# EAGLE schematic hm3_redraw (EAGLE 8.5.1)
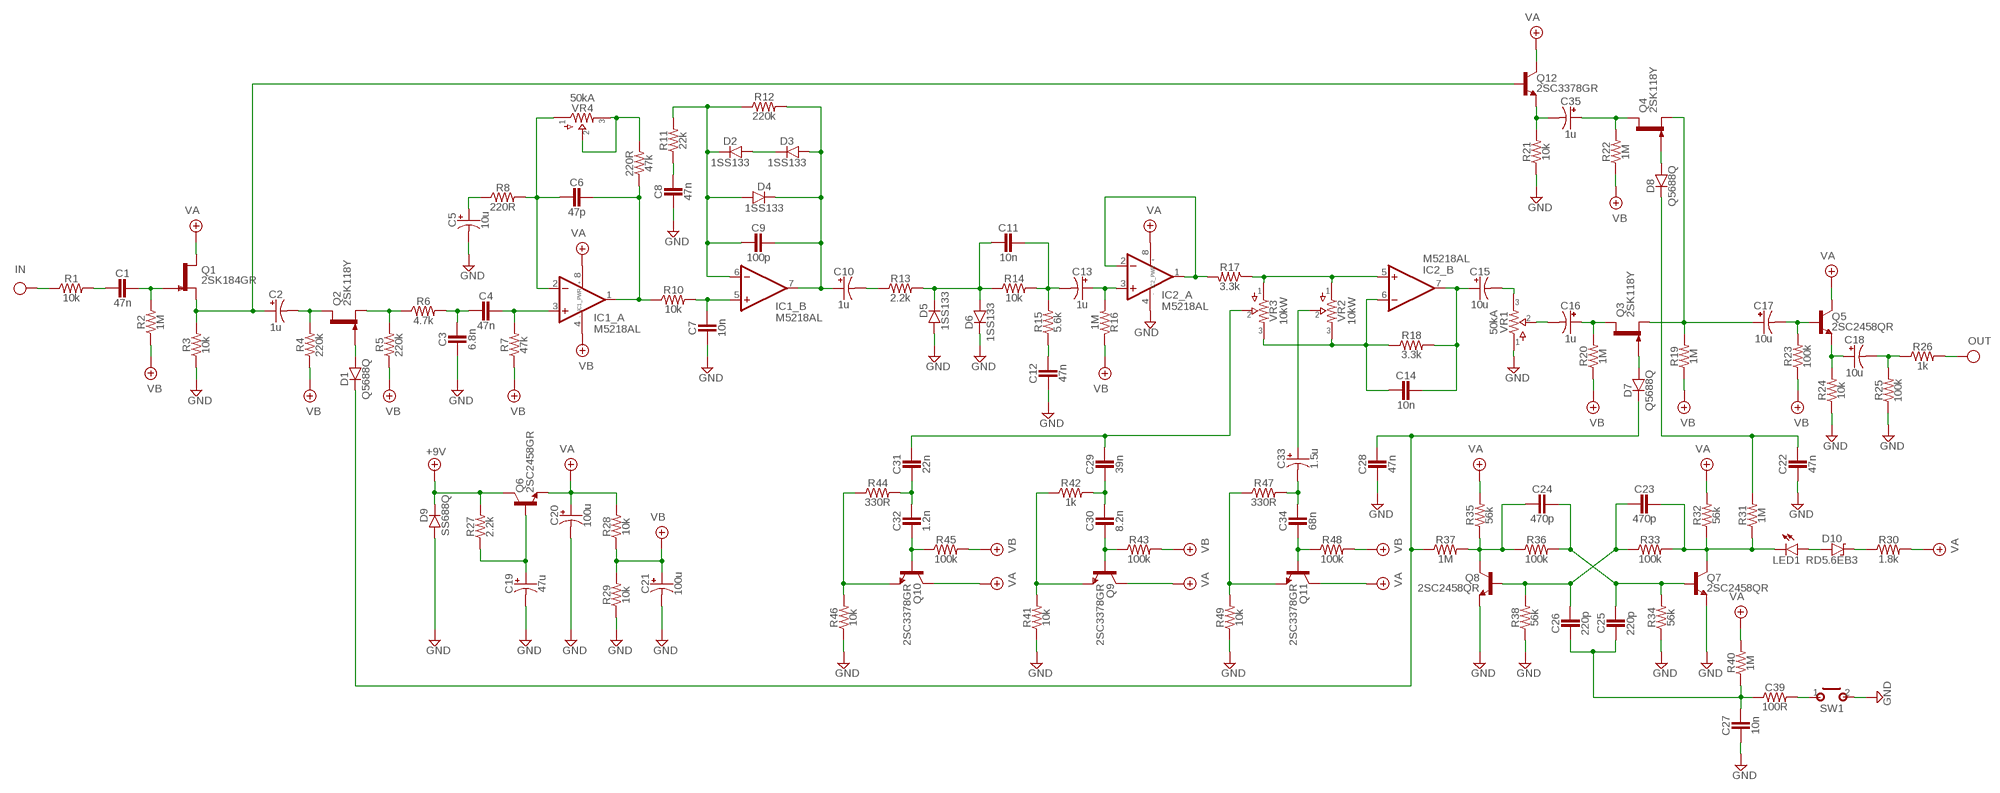
[diagram p0: schematic, sheet 1]

## Parts
220R  47k  R_.3B  [R0207/3]
C1  47n  CER/FILMBOX.1  [BOX_SMALL]
C2  1u  0500  [050_020]
C3  6.8n  CER/FILMBOX.1  [BOX_SMALL]
C4  47n  CER/FILMBOX.1  [BOX_SMALL]
C5  10u  0500  [050_020]
C6  47p  CER/FILMBOX.1  [BOX_SMALL]
C7  10n  CER/FILMBOX.1  [BOX_SMALL]
C8  47n  CER/FILMBOX.1  [BOX_SMALL]
C9  100p  CER/FILMBOX.1  [BOX_SMALL]
C10  1u  0500  [050_020]
C11  10n  CER/FILMBOX.1  [BOX_SMALL]
C12  47n  CER/FILMBOX.1  [BOX_SMALL]
C13  1u  0500  [050_020]
C14  10n  CER/FILMBOX.1  [BOX_SMALL]
C15  10u  0500  [050_020]
C16  1u  0500  [050_020]
C17  10u  0500  [050_020]
C18  10u  0500  [050_020]
C19  47u  0500  [050_020]
C20  100u  0500  [050_020]
C21  100u  0500  [050_020]
C22  47n  CER/FILMBOX.1  [BOX_SMALL]
C23  470p  CER/FILMBOX.1  [BOX_SMALL]
C24  470p  CER/FILMBOX.1  [BOX_SMALL]
C25  220p  CER/FILMBOX.1  [BOX_SMALL]
C26  220p  CER/FILMBOX.1  [BOX_SMALL]
C27  10n  CER/FILMBOX.1  [BOX_SMALL]
C28  47n  CER/FILMBOX.1  [BOX_SMALL]
C29  39n  CER/FILMBOX.1  [BOX_SMALL]
C30  8.2n  CER/FILMBOX.1  [BOX_SMALL]
C31  22n  CER/FILMBOX.1  [BOX_SMALL]
C32  1.2n  CER/FILMBOX.1  [BOX_SMALL]
C33  1.5u  0500  [050_020]
C34  68n  CER/FILMBOX.1  [BOX_SMALL]
C35  1u  0500  [050_020]
C39  100R  R_.3B  [R0207/3]
D1  Q5688Q  DO35.2  [DO35-2]
D2  1SS133  DO35.2  [DO35-2]
D3  1SS133  DO35.2  [DO35-2]
D4  1SS133  DO35.2  [DO35-2]
D5  1SS133  DO35.2  [DO35-2]
D6  1SS133  DO35.2  [DO35-2]
D7  Q5688Q  DO35.2  [DO35-2]
D8  Q5688Q  DO35.2  [DO35-2]
D9  SS688Q  DO35.2  [DO35-2]
D10  RD5.6EB3  ZENER.2  [DO41-2]
IC1  M5218AL  DUALTH  [DIL0]
IC2  M5218AL  DUALSIL  [SIL08]
LED1  LED  [3MM_D]
Q1  2SK184GR  2N5457  [TO92-]
Q2  2SK118Y  2N5457  [TO92-]
Q3  2SK118Y  2N5457  [TO92-]
Q4  2SK118Y  2N5457  [TO92-]
Q5  2SC2458QR  2SC828A  [TO92-]
Q6  2SC2458GR  2SC828A  [TO92-]
Q7  2SC2458QR  2SC828A  [TO92-]
Q8  2SC2458QR  2SC828A  [TO92-]
Q9  2SC3378GR  2SC828A  [TO92-]
Q10  2SC3378GR  2SC828A  [TO92-]
Q11  2SC3378GR  2SC828A  [TO92-]
Q12  2SC3378GR  2SC828A  [TO92-]
R1  10k  R_.3B  [R0207/3]
R2  1M  R_.3B  [R0207/3]
R3  10k  R_.3B  [R0207/3]
R4  220k  R_.3B  [R0207/3]
R5  220k  R_.3B  [R0207/3]
R6  4.7k  R_.3B  [R0207/3]
R7  47k  R_.3B  [R0207/3]
R8  220R  R_.3B  [R0207/3]
R10  10k  R_.3B  [R0207/3]
R11  22k  R_.3B  [R0207/3]
R12  220k  R_.3B  [R0207/3]
R13  2.2k  R_.3B  [R0207/3]
R14  10k  R_.3B  [R0207/3]
R15  5.6k  R_.3B  [R0207/3]
R16  1M  R_.3B  [R0207/3]
R17  3.3k  R_.3B  [R0207/3]
R18  3.3k  R_.3B  [R0207/3]
R19  1M  R_.3B  [R0207/3]
R20  1M  R_.3B  [R0207/3]
R21  10k  R_.3B  [R0207/3]
R22  1M  R_.3B  [R0207/3]
R23  100k  R_.3B  [R0207/3]
R24  10k  R_.3B  [R0207/3]
R25  100k  R_.3B  [R0207/3]
R26  1k  R_.3B  [R0207/3]
R27  2.2k  R_.3B  [R0207/3]
R28  10k  R_.3B  [R0207/3]
R29  10k  R_.3B  [R0207/3]
R30  1.8k  R_.3B  [R0207/3]
R31  1M  R_.3B  [R0207/3]
R32  56k  R_.3B  [R0207/3]
R33  100k  R_.3B  [R0207/3]
R34  56k  R_.3B  [R0207/3]
R35  56k  R_.3B  [R0207/3]
R36  100k  R_.3B  [R0207/3]
R37  1M  R_.3B  [R0207/3]
R38  56k  R_.3B  [R0207/3]
R40  1M  R_.3B  [R0207/3]
R41  10k  R_.3B  [R0207/3]
R42  1k  R_.3B  [R0207/3]
R43  100k  R_.3B  [R0207/3]
R44  330R  R_.3B  [R0207/3]
R45  100k  R_.3B  [R0207/3]
R46  10k  R_.3B  [R0207/3]
R47  330R  R_.3B  [R0207/3]
R48  100k  R_.3B  [R0207/3]
R49  10k  R_.3B  [R0207/3]
SW1  MOMENTARY  [SPST]
VR1  50kA  POTS16MM  [16MM]
VR2  10kW  POTS16MM  [16MM]
VR3  10kW  POTS16MM  [16MM]
VR4  50kA  POTS16MM  [16MM]

## Nets
+9V: D9.C Q6.2(C) R27.2
GND: C3.2 C5.- C7.2 C8.2 C12.2 C19.- C20.- C21.- C22.2 C27.2 C28.2 D5.A D6.C D9.A IC2.4(_PWR:V-) Q7.3(E) Q8.3(E) R3.1 R21.1 R24.1 R25.1 R29.1 R34.1 R38.1 R41.1 R46.1 R49.1 SW1.2(S) VR1.1
IN: R1.1
N$1: C16.- VR1.2
N$2: C14.2 IC2.6(_B:-IN) R18.1 VR2.3 VR3.3
N$3: C19.+ Q6.1(B) R27.1
N$4: C1.2 R1.2
N$5: C1.1 Q1.1(G) R2.2
N$6: C2.+ Q1.2(S) Q12.1(B) R3.2
N$7: C2.- Q2.3(D) R4.2
N$8: Q2.2(S) R5.2 R6.1
N$9: D1.A Q2.1(G)
N$10: C3.1 C4.2 R6.2
N$11: C4.1 IC1.3(_A:+IN) R7.2
N$12: C5.+ R8.1
N$13: C6.2 IC1.2(_A:-IN) R8.2 VR4.1
N$14: 220R.1 C6.1 IC1.1(_A:OUT) R10.1
N$15: 220R.2 VR4.2 VR4.3
N$16: C7.1 IC1.5(_B:+IN) R10.2
N$17: C9.2 D2.C D4.A IC1.6(_B:-IN) R11.2 R12.1
N$18: C9.1 C10.+ D3.A D4.C IC1.7(_B:OUT) R12.2
N$19: D2.A D3.C
N$20: C8.1 R11.1
N$21: C10.- R13.1
N$22: C11.2 D5.C D6.A R13.2 R14.1
N$23: C11.1 C13.- R14.2 R15.2
N$24: C12.1 R15.1
N$25: IC2.1(_A:OUT) IC2.2(_A:-IN) R17.2
N$26: C13.+ IC2.3(_A:+IN) R16.2
N$27: C22.1 D8.C R31.2
N$29: C24.2 Q8.2(C) R35.1 R36.1 R37.2
N$30: C14.1 C15.+ IC2.7(_B:OUT) R18.2
N$31: C23.1 LED1.P$1(C) Q7.2(C) R31.1 R32.1 R33.2
N$32: C23.2 C26.1 Q8.1(B) R33.1 R38.2
N$33: IC2.5(_B:+IN) R17.1 VR2.1 VR3.1
N$34: C24.1 C25.1 Q7.1(B) R34.2 R36.2
N$35: C15.- VR1.3
N$36: C33.+ VR2.2
N$37: Q11.3(E) R47.1 R49.2
N$38: C34.2 Q11.1(B) R48.1
N$39: C33.- C34.1 R47.2
N$40: C29.1 C31.1 VR3.2
N$41: Q9.3(E) R41.2 R42.1
N$42: C30.2 Q9.1(B) R43.1
N$43: C29.2 C30.1 R42.2
N$44: Q10.3(E) R44.1 R46.2
N$45: C32.2 Q10.1(B) R45.1
N$46: C31.2 C32.1 R44.2
N$48: C16.+ Q3.3(D) R20.2
N$49: C17.+ Q3.2(S) Q4.2(S) R19.2
N$50: D7.A Q3.1(G)
N$51: C35.- Q12.3(E) R21.2
N$52: C35.+ Q4.3(D) R22.2
N$53: D8.A Q4.1(G)
N$55: C18.- R25.2 R26.1
N$56: C18.+ Q5.3(E) R24.2
N$57: C17.- Q5.1(B) R23.2
N$58: C39.2 SW1.1(P)
N$59: C28.1 D1.C D7.C R37.1
N$61: D10.A LED1.ANODE(A)
N$62: D10.C R30.1
N$71: C25.2 C26.2 C27.1 C39.1 R40.1
OUT: R26.2
VA: C20.+ IC1.8(_PWR:V+) IC2.8(_PWR:V+) Q1.3(D) Q5.2(C) Q6.3(E) Q9.2(C) Q10.2(C) Q11.2(C) Q12.2(C) R28.2 R30.2 R32.2 R35.2 R40.2
VB: C21.+ IC1.4(_PWR:V-) R2.1 R4.1 R5.1 R7.1 R16.1 R19.1 R20.1 R22.1 R23.1 R28.1 R29.2 R43.2 R45.2 R48.2

## Library data of the parts
220R C39 R1-R8 R10-R38 R40-R49 = pedals-resistors:R_
C1 C3 C4 C6-C9 C11 C12 C14 C22-C32 C34 = pedals-capacitors-film:CER/FILM: 47 - 120pF Xicon Ceramic Disc 2.5mm lead spacing
C2 C5 C10 C13 C15-C21 C33 C35 = pedals-capacitors-elec:050
D1-D9 = pedals-diodes:DO35: DO-35 Package Diodes: 1N914
D10 = pedals-diodes:ZENER
IC1 IC2 = pedals-integrated circuits:DUAL: OP AMP
LED1 = pedals-diodes:LED
Q1-Q4 = pedals-transistors:2N5457: N-CHANNEL JFET
Q5-Q12 = pedals-transistors:2SC828A
SW1 = pedals-switches:MOMENTARY
VR1-VR4 = pedals-potentiometers:POTS